# EAGLE design msp430fr5994-LQFP_80 (EAGLE 7.5.0)

## Sheet 1 of 2
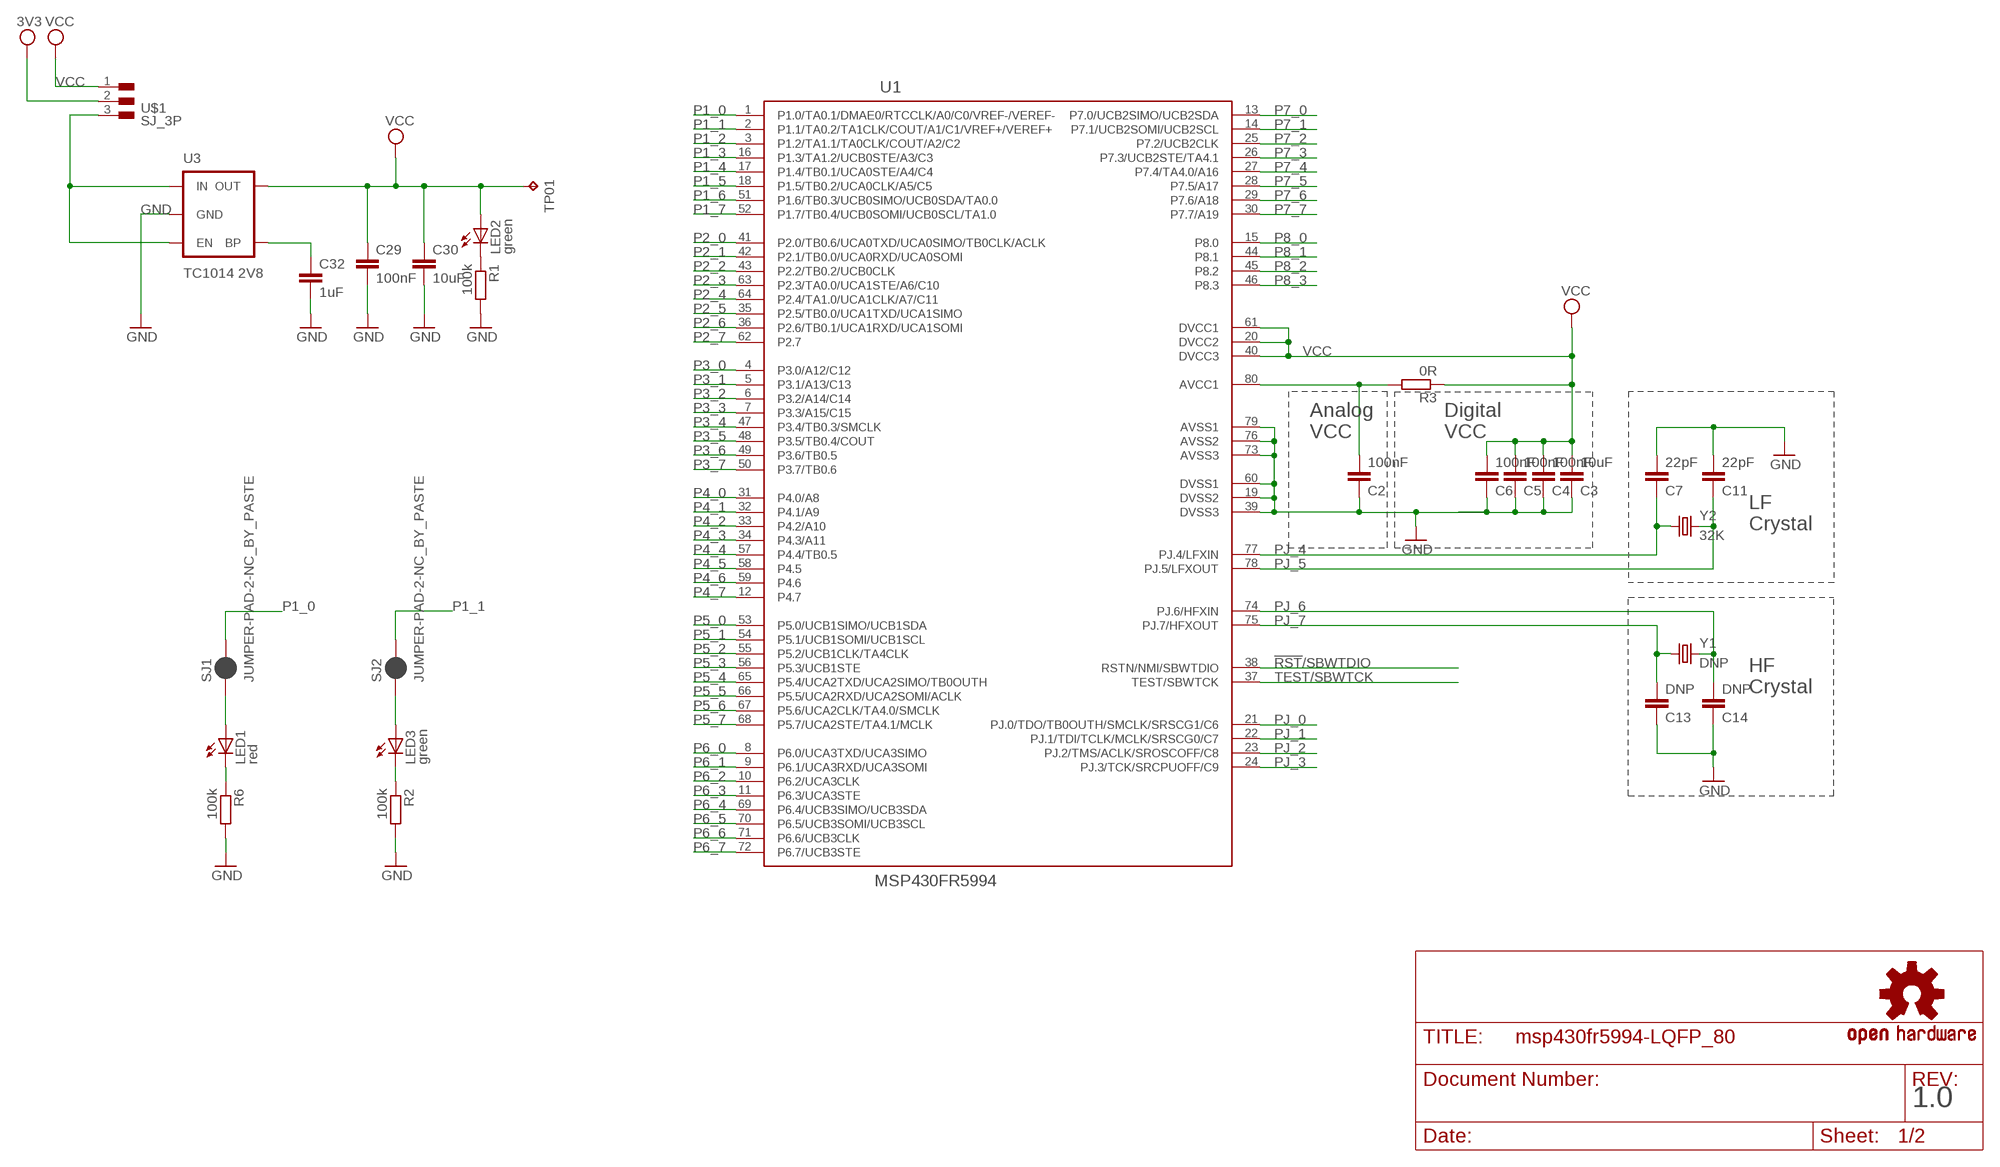
[diagram p0: schematic, sheet 1]

### Parts
C2  100nF  C-EUC0805  [C0805]
C3  10uF  C-EUC0805  [C0805]
C4  100nF  C-EUC0805  [C0805]
C5  100nF  C-EUC0805  [C0805]
C6  100nF  C-EUC0805  [C0805]
C7  22pF  C-EUC0805  [C0805]
C11  22pF  C-EUC0805  [C0805]
C13  DNP  C-EUC0805  [C0805]
C14  DNP  C-EUC0805  [C0805]
C29  100nF  C-EUC0805  [C0805]
C30  10uF  C-EUC1206  [C1206]
C32  1uF  C-EUC0805  [C0805]
LED1  red  LEDCHIPLED_0805  [CHIPLED_0805]
LED2  green  LEDCHIPLED_0805  [CHIPLED_0805]
LED3  green  LEDCHIPLED_0805  [CHIPLED_0805]
R1  100k  R-EU_R0805W  [R0805W]
R2  100k  R-EU_R0805W  [R0805W]
R3  0R  R-EU_R0805W  [R0805W]
R6  100k  R-EU_R0805W  [R0805W]
SJ1  JUMPER-PAD-2-NC_BY_PASTE  [PAD-JUMPER-2-NC_BY_PASTE_YES_SILK]
SJ2  JUMPER-PAD-2-NC_BY_PASTE  [PAD-JUMPER-2-NC_BY_PASTE_YES_SILK]
TP01  TPTP12R  [TP12R]
U1  MSP430FR5994  [PN80]
U3  TC1014 2V8  V_REG_LDOSMD  [SOT23-5]
U$1  SJ_3P  [SJ_3P]
U$7  OSHW-LOGOM  [OSHW-LOGO-M]
Y1  DNP  CRYSTAL  [CRYSTAL-SMD-11.4X4.35]
Y2  32K  CRYSTAL3.2X1.5  [CRYSTAL-SMD-3.2X1.5]

### Nets
3V3: U$1.2 ; also sheet 2
!RST!/SBWTDIO: U1.38(RSTN/NMI/SBWTDIO) ; also sheet 2
GND: C2.1 C3.1 C4.1 C5.1 C6.1 C7.2 C11.2 C13.1 C14.1 C29.2 C30.2 C32.2 R1.2 R2.2 R6.2 U1.19(DVSS2) U1.39(DVSS3) U1.60(DVSS1) U1.73(AVSS3) U1.76(AVSS2) U1.79(AVSS1) U3.2(GND) ; also sheet 2
N$1: U3.1(IN) U3.3(EN) U$1.3
N$2: C2.2 R3.2 U1.80(AVCC1)
N$3: LED2.C R1.1
N$4: LED1.A SJ1.1
N$5: LED3.C R2.1
N$6: LED3.A SJ2.1
N$8: LED1.C R6.1
N$50: C32.1 U3.4(BP)
P1_0: SJ1.2 U1.1(P1.0/TA0.1/DMAE0/RTCCLK/A0/C0/VREF-/VEREF-) ; also sheet 2
P1_1: SJ2.2 U1.2(P1.1/TA0.2/TA1CLK/COUT/A1/C1/VREF+/VEREF+) ; also sheet 2
P1_2: U1.3(P1.2/TA1.1/TA0CLK/COUT/A2/C2) ; also sheet 2
P1_3: U1.16(P1.3/TA1.2/UCB0STE/A3/C3) ; also sheet 2
P1_4: U1.17(P1.4/TB0.1/UCA0STE/A4/C4) ; also sheet 2
P1_5: U1.18(P1.5/TB0.2/UCA0CLK/A5/C5) ; also sheet 2
P1_6: U1.51(P1.6/TB0.3/UCB0SIMO/UCB0SDA/TA0.0) ; also sheet 2
P1_7: U1.52(P1.7/TB0.4/UCB0SOMI/UCB0SCL/TA1.0) ; also sheet 2
P2_0: U1.41(P2.0/TB0.6/UCA0TXD/UCA0SIMO/TB0CLK/ACLK) ; also sheet 2
P2_1: U1.42(P2.1/TB0.0/UCA0RXD/UCA0SOMI) ; also sheet 2
P2_2: U1.43(P2.2/TB0.2/UCB0CLK) ; also sheet 2
P2_3: U1.63(P2.3/TA0.0/UCA1STE/A6/C10) ; also sheet 2
P2_4: U1.64(P2.4/TA1.0/UCA1CLK/A7/C11) ; also sheet 2
P2_5: U1.35(P2.5/TB0.0/UCA1TXD/UCA1SIMO) ; also sheet 2
P2_6: U1.36(P2.6/TB0.1/UCA1RXD/UCA1SOMI) ; also sheet 2
P2_7: U1.62(P2.7) ; also sheet 2
P3_0: U1.4(P3.0/A12/C12) ; also sheet 2
P3_1: U1.5(P3.1/A13/C13) ; also sheet 2
P3_2: U1.6(P3.2/A14/C14) ; also sheet 2
P3_3: U1.7(P3.3/A15/C15) ; also sheet 2
P3_4: U1.47(P3.4/TB0.3/SMCLK) ; also sheet 2
P3_5: U1.48(P3.5/TB0.4/COUT) ; also sheet 2
P3_6: U1.49(P3.6/TB0.5) ; also sheet 2
P3_7: U1.50(P3.7/TB0.6) ; also sheet 2
P4_0: U1.31(P4.0/A8) ; also sheet 2
P4_1: U1.32(P4.1/A9) ; also sheet 2
P4_2: U1.33(P4.2/A10) ; also sheet 2
P4_3: U1.34(P4.3/A11) ; also sheet 2
P4_4: U1.57(P4.4/TB0.5) ; also sheet 2
P4_5: U1.58(P4.5) ; also sheet 2
P4_6: U1.59(P4.6) ; also sheet 2
P4_7: U1.12(P4.7) ; also sheet 2
P5_0: U1.53(P5.0/UCB1SIMO/UCB1SDA) ; also sheet 2
P5_1: U1.54(P5.1/UCB1SOMI/UCB1SCL) ; also sheet 2
P5_2: U1.55(P5.2/UCB1CLK/TA4CLK) ; also sheet 2
P5_3: U1.56(P5.3/UCB1STE) ; also sheet 2
P5_4: U1.65(P5.4/UCA2TXD/UCA2SIMO/TB0OUTH) ; also sheet 2
P5_5: U1.66(P5.5/UCA2RXD/UCA2SOMI/ACLK) ; also sheet 2
P5_6: U1.67(P5.6/UCA2CLK/TA4.0/SMCLK) ; also sheet 2
P5_7: U1.68(P5.7/UCA2STE/TA4.1/MCLK) ; also sheet 2
P6_0: U1.8(P6.0/UCA3TXD/UCA3SIMO) ; also sheet 2
P6_1: U1.9(P6.1/UCA3RXD/UCA3SOMI) ; also sheet 2
P6_2: U1.10(P6.2/UCA3CLK) ; also sheet 2
P6_3: U1.11(P6.3/UCA3STE) ; also sheet 2
P6_4: U1.69(P6.4/UCB3SIMO/UCB3SDA) ; also sheet 2
P6_5: U1.70(P6.5/UCB3SOMI/UCB3SCL) ; also sheet 2
P6_6: U1.71(P6.6/UCB3CLK) ; also sheet 2
P6_7: U1.72(P6.7/UCB3STE) ; also sheet 2
P7_0: U1.13(P7.0/UCB2SIMO/UCB2SDA) ; also sheet 2
P7_1: U1.14(P7.1/UCB2SOMI/UCB2SCL) ; also sheet 2
P7_2: U1.25(P7.2/UCB2CLK) ; also sheet 2
P7_3: U1.26(P7.3/UCB2STE/TA4.1) ; also sheet 2
P7_4: U1.27(P7.4/TA4.0/A16) ; also sheet 2
P7_5: U1.28(P7.5/A17) ; also sheet 2
P7_6: U1.29(P7.6/A18) ; also sheet 2
P7_7: U1.30(P7.7/A19) ; also sheet 2
P8_0: U1.15(P8.0) ; also sheet 2
P8_1: U1.44(P8.1) ; also sheet 2
P8_2: U1.45(P8.2) ; also sheet 2
P8_3: U1.46(P8.3) ; also sheet 2
PJ_0: U1.21(PJ.0/TDO/TB0OUTH/SMCLK/SRSCG1/C6) ; also sheet 2
PJ_1: U1.22(PJ.1/TDI/TCLK/MCLK/SRSCG0/C7) ; also sheet 2
PJ_2: U1.23(PJ.2/TMS/ACLK/SROSCOFF/C8) ; also sheet 2
PJ_3: U1.24(PJ.3/TCK/SRCPUOFF/C9) ; also sheet 2
PJ_4: C7.1 U1.77(PJ.4/LFXIN) Y2.P$1
PJ_5: C11.1 U1.78(PJ.5/LFXOUT) Y2.P$2
PJ_6: C14.2 U1.74(PJ.6/HFXIN) Y1.2
PJ_7: C13.2 U1.75(PJ.7/HFXOUT) Y1.1
TEST/SBWTCK: U1.37(TEST/SBWTCK) ; also sheet 2
VCC: C3.2 C4.2 C5.2 C6.2 C29.1 C30.1 LED2.A R3.1 TP01.TP U1.20(DVCC2) U1.40(DVCC3) U1.61(DVCC1) U3.5(OUT) U$1.1 ; also sheet 2

### Notes on the sheet
- Analog | Digital
- VCC | VCC
- LF
- Crystal
- HF
- Crystal
- 1.0

## Sheet 2 of 2
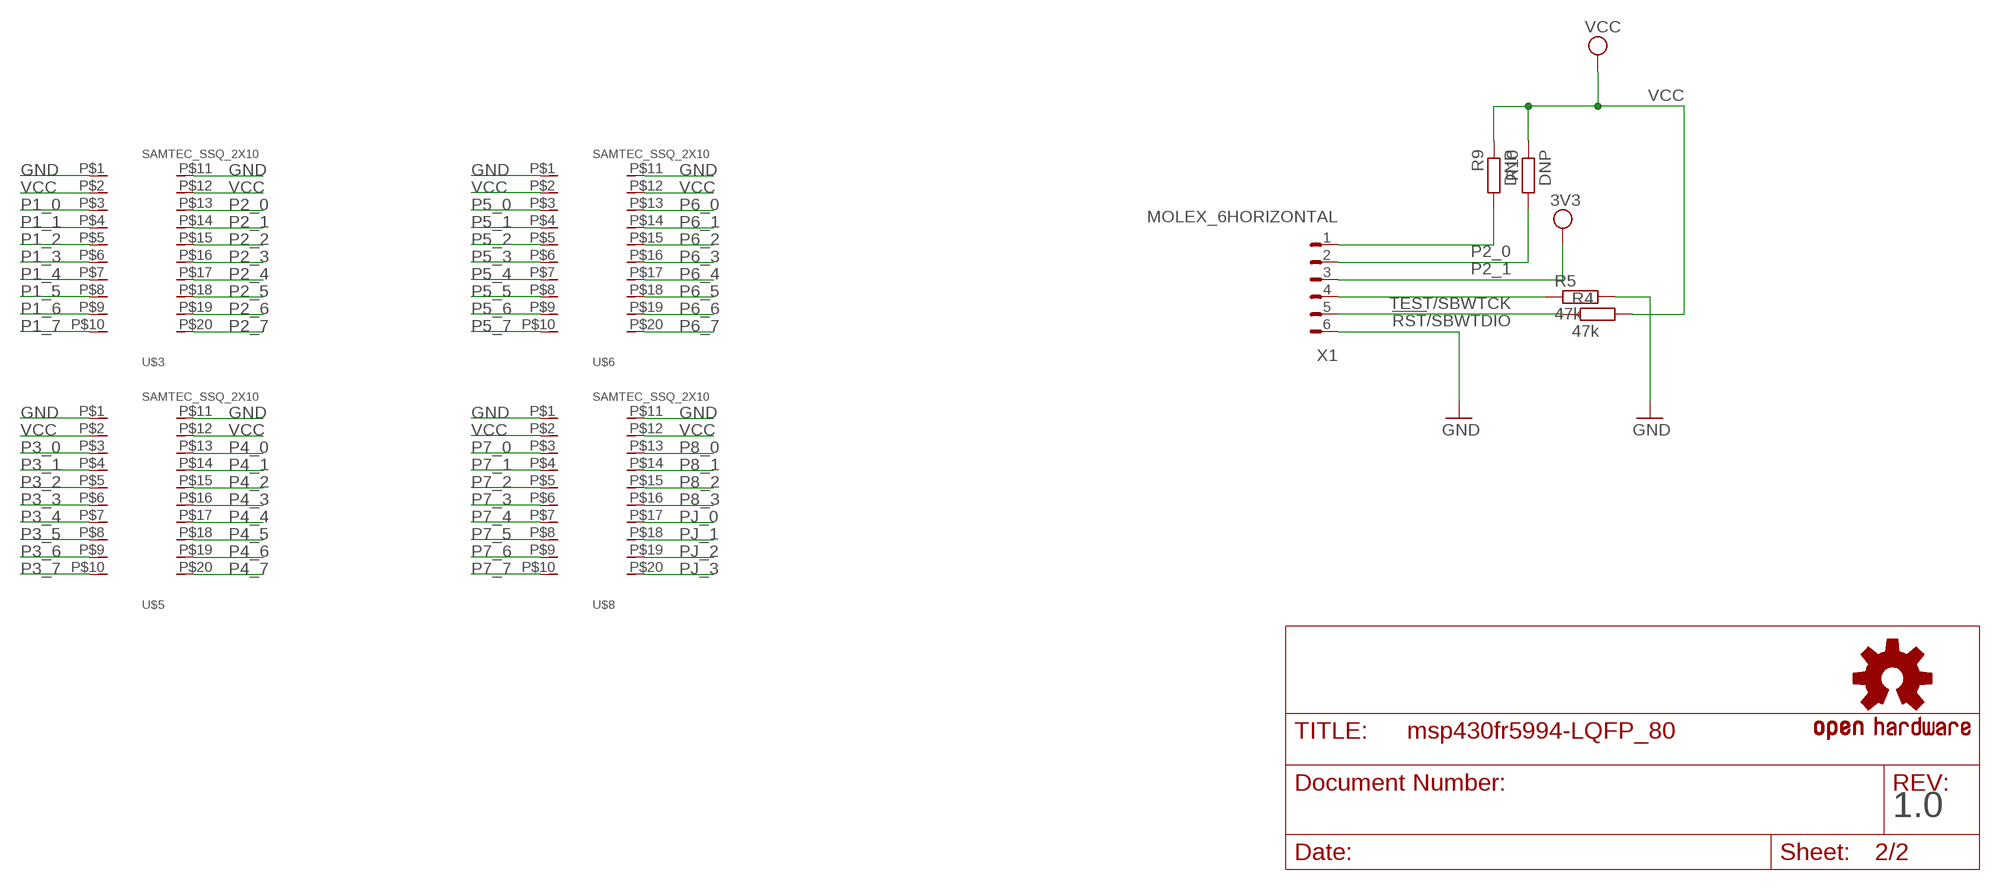
[diagram p1: schematic, sheet 2]

### Parts
R4  47k  R-EU_R0805W  [R0805W]
R5  47k  R-EU_R0805W  [R0805W]
R9  DNP  R-EU_R0805W  [R0805W]
R10  DNP  R-EU_R0805W  [R0805W]
U$2  OSHW-LOGOM  [OSHW-LOGO-M]
U$3  SAMTEC_SSQ_2X10  [SSQ-110-03-G-D]
U$5  SAMTEC_SSQ_2X10  [SSQ-110-03-G-D]
U$6  SAMTEC_SSQ_2X10  [SSQ-110-03-G-D]
U$8  SAMTEC_SSQ_2X10  [SSQ-110-03-G-D]
X1  MOLEX_6HORIZONTAL  [0530480610]

### Nets
3V3: X1.3 ; also sheet 1
!RST!/SBWTDIO: R4.1 X1.5 ; also sheet 1
GND: R5.2 U$3.P$1 U$3.P$11 U$5.P$1 U$5.P$11 U$6.P$1 U$6.P$11 U$8.P$1 U$8.P$11 X1.6 ; also sheet 1
P1_0: U$3.P$3 ; also sheet 1
P1_1: U$3.P$4 ; also sheet 1
P1_2: U$3.P$5 ; also sheet 1
P1_3: U$3.P$6 ; also sheet 1
P1_4: U$3.P$7 ; also sheet 1
P1_5: U$3.P$8 ; also sheet 1
P1_6: U$3.P$9 ; also sheet 1
P1_7: U$3.P$10 ; also sheet 1
P2_0: R9.2 U$3.P$13 X1.1 ; also sheet 1
P2_1: R10.2 U$3.P$14 X1.2 ; also sheet 1
P2_2: U$3.P$15 ; also sheet 1
P2_3: U$3.P$16 ; also sheet 1
P2_4: U$3.P$17 ; also sheet 1
P2_5: U$3.P$18 ; also sheet 1
P2_6: U$3.P$19 ; also sheet 1
P2_7: U$3.P$20 ; also sheet 1
P3_0: U$5.P$3 ; also sheet 1
P3_1: U$5.P$4 ; also sheet 1
P3_2: U$5.P$5 ; also sheet 1
P3_3: U$5.P$6 ; also sheet 1
P3_4: U$5.P$7 ; also sheet 1
P3_5: U$5.P$8 ; also sheet 1
P3_6: U$5.P$9 ; also sheet 1
P3_7: U$5.P$10 ; also sheet 1
P4_0: U$5.P$13 ; also sheet 1
P4_1: U$5.P$14 ; also sheet 1
P4_2: U$5.P$15 ; also sheet 1
P4_3: U$5.P$16 ; also sheet 1
P4_4: U$5.P$17 ; also sheet 1
P4_5: U$5.P$18 ; also sheet 1
P4_6: U$5.P$19 ; also sheet 1
P4_7: U$5.P$20 ; also sheet 1
P5_0: U$6.P$3 ; also sheet 1
P5_1: U$6.P$4 ; also sheet 1
P5_2: U$6.P$5 ; also sheet 1
P5_3: U$6.P$6 ; also sheet 1
P5_4: U$6.P$7 ; also sheet 1
P5_5: U$6.P$8 ; also sheet 1
P5_6: U$6.P$9 ; also sheet 1
P5_7: U$6.P$10 ; also sheet 1
P6_0: U$6.P$13 ; also sheet 1
P6_1: U$6.P$14 ; also sheet 1
P6_2: U$6.P$15 ; also sheet 1
P6_3: U$6.P$16 ; also sheet 1
P6_4: U$6.P$17 ; also sheet 1
P6_5: U$6.P$18 ; also sheet 1
P6_6: U$6.P$19 ; also sheet 1
P6_7: U$6.P$20 ; also sheet 1
P7_0: U$8.P$3 ; also sheet 1
P7_1: U$8.P$4 ; also sheet 1
P7_2: U$8.P$5 ; also sheet 1
P7_3: U$8.P$6 ; also sheet 1
P7_4: U$8.P$7 ; also sheet 1
P7_5: U$8.P$8 ; also sheet 1
P7_6: U$8.P$9 ; also sheet 1
P7_7: U$8.P$10 ; also sheet 1
P8_0: U$8.P$13 ; also sheet 1
P8_1: U$8.P$14 ; also sheet 1
P8_2: U$8.P$15 ; also sheet 1
P8_3: U$8.P$16 ; also sheet 1
PJ_0: U$8.P$17 ; also sheet 1
PJ_1: U$8.P$18 ; also sheet 1
PJ_2: U$8.P$19 ; also sheet 1
PJ_3: U$8.P$20 ; also sheet 1
TEST/SBWTCK: R5.1 X1.4 ; also sheet 1
VCC: R4.2 R9.1 R10.1 U$3.P$2 U$3.P$12 U$5.P$2 U$5.P$12 U$6.P$2 U$6.P$12 U$8.P$2 U$8.P$12 ; also sheet 1

### Notes on the sheet
- 1.0

## Library data of the parts
C2-C7 C11 C13 C14 C29 C30 C32 = rcl:C-EU: CAPACITOR, European symbol
LED1-LED3 = led:LED: LED OSRAM: - CHIPLED LG R971, LG N971, LY N971, LG Q971, LY Q971, LO R971, LY R971 LH N974, LH R974 LS Q976, LO Q976, LY Q976 LO Q996 - Hyper CHIPLED LW Q18S LB Q993, LB Q99A, LB R99A - SideLED LS A670, LO A670, LY A670, LG A670, LP A670 LB A673, LV A673, LT A673, LW A673 LH A674 LY A675 LS A676, LA A676, LO A676, LY A676, LW A676 LS A679, LY A679, LG A679 - Hyper Micro SIDELED® LS Y876, LA Y876, LO Y876, LY Y876 LT Y87S - SmartLED LW L88C, LW L88S LB L89C, LB L89S, LG L890 LS L89K, LO L89K, LY L89K LS L896, LA L896, LO L896, LY L896 - TOPLED LS T670, LO T670, LY T670, LG T670, LP T670 LSG T670, LSP T670, LSY T670, LOP T670, LYG T670 LG T671, LOG T671, LSG T671 LB T673, LV T673, LT T673, LW T673 LH T674 LS T676, LA T676, LO T676, LY T676, LB T676, LH T676, LSB T676, LW T676 LB T67C, LV T67C, LT T67C, LS T67K, LO T67K, LY T67K, LW E67C LS E67B, LA E67B, LO E67B, LY E67B, LB E67C, LV E67C, LT E67C LW T67C LS T679, LY T679, LG T679 LS T770, LO T770, LY T770, LG T770, LP T770 LB T773, LV T773, LT T773, LW T773 LH T774 LS E675, LA E675, LY E675, LS T675 LS T776, LA T776, LO T776, LY T776, LB T776 LHGB T686 LT T68C, LB T68C - Hyper Mini TOPLED® LB M676 - Mini TOPLED Santana® LG M470 LS M47K, LO M47K, LY M47K Source: http://www.osram.convergy.de LUXEON: - LUMILED® LXK2-PW12-R00, LXK2-PW12-S00, LXK2-PW14-U00, LXK2-PW14-V00 LXK2-PM12-R00, LXK2-PM12-S00, LXK2-PM14-U00 LXK2-PE12-Q00, LXK2-PE12-R00, LXK2-PE12-S00, LXK2-PE14-T00, LXK2-PE14-U00 LXK2-PB12-K00, LXK2-PB12-L00, LXK2-PB12-M00, LXK2-PB14-N00, LXK2-PB14-P00, LXK2-PB14-Q00 LXK2-PR12-L00, LXK2-PR12-M00, LXK2-PR14-Q00, LXK2-PR14-R00 LXK2-PD12-Q00, LXK2-PD12-R00, LXK2-PD12-S00 LXK2-PH12-R00, LXK2-PH12-S00 LXK2-PL12-P00, LXK2-PL12-Q00, LXK2-PL12-R00 Source: www.luxeon.com KINGBRIGHT: KA-3528ASYC Source: www.kingbright.com
R1-R6 R9 R10 = rcl:R-EU_: RESISTOR, European symbol
SJ1 SJ2 = SparkFun-Passives:JUMPER-PAD-2-NC_BY_PASTE
TP01 = testpad:TP: Test pad
U1 = MSP_IC:MSP430FR5994
U3 = SparkFun:V_REG_LDO: Voltage Regulator LDO Standard 150mA LDO voltage regulator in SOT-23 layout. Micrel part MIC5205. BP (by-pass) pin is used to lower output noise with 470pF cap.
U$1 = Simplex-Jumpers:SJ_3P: solder jumper 3 pin
U$2 U$7 = SparkFun:OSHW-LOGO: Open Source Hardware Logo This logo indicates the piece of hardware it is found on incorporates a OSHW license and/or adheres to the definition of open source hardware found here: http://freedomdefined.org/OSHW
U$3 U$5 U$6 U$8 = Simplex-Connectors:SAMTEC_SSQ_2X10: Samtec SSQ 2x10 pin header
X1 = Simplex-Connectors:MOLEX_6: Molex 6 pin connectors 1.25mm PicoBlade
Y1 Y2 = Simplex-FreqCtrl:CRYSTAL: smd crystals

## Net classes
0 default: width 0.254 mm
1 vcc: width 0.203 mm

## Board
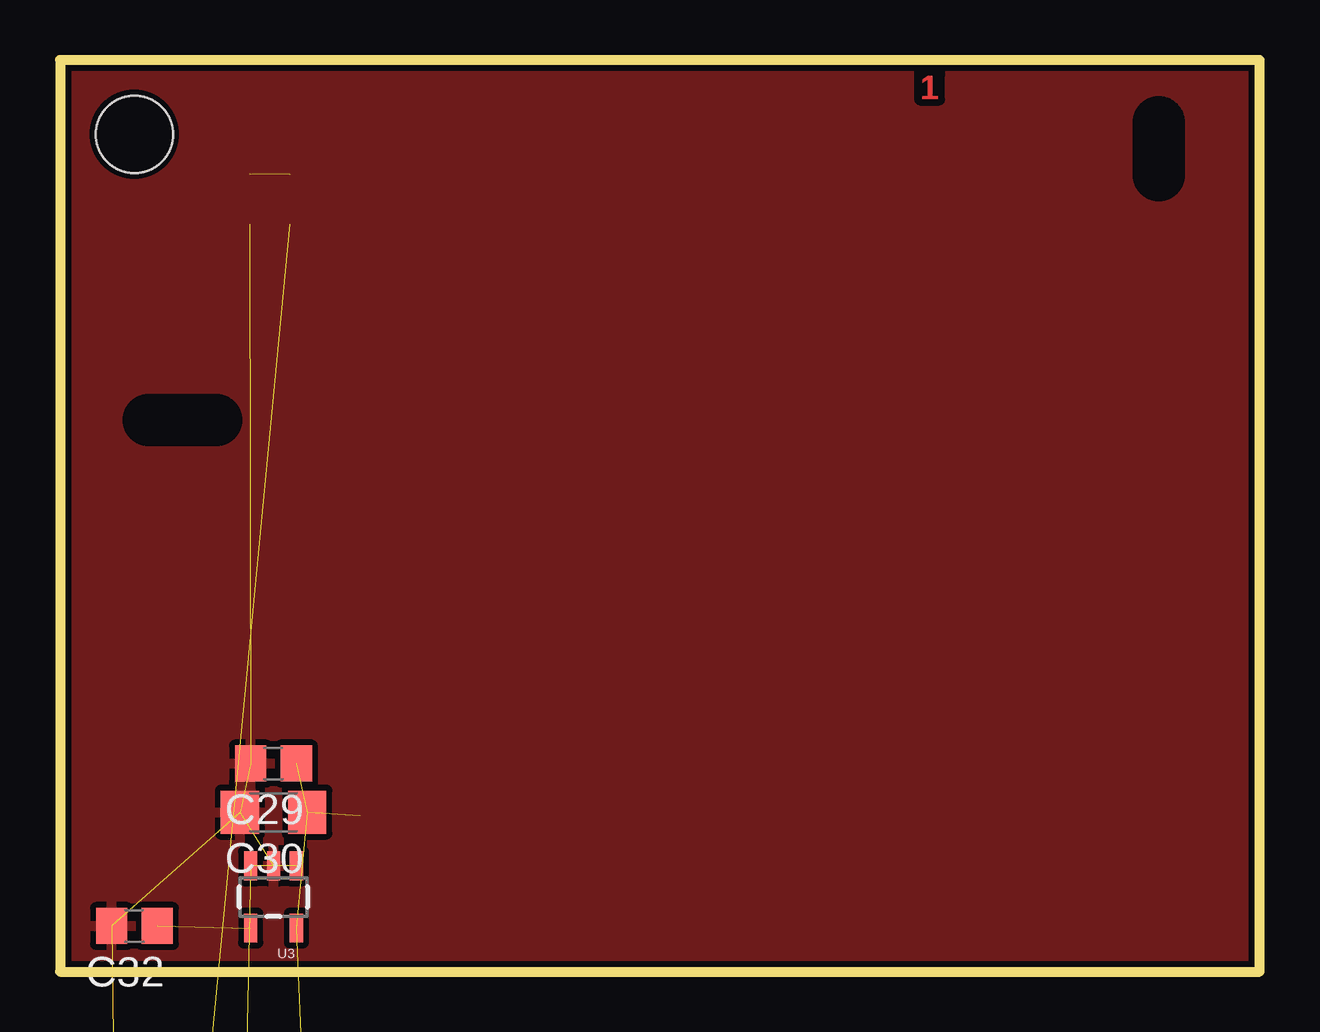
[diagram p2: board, top side]
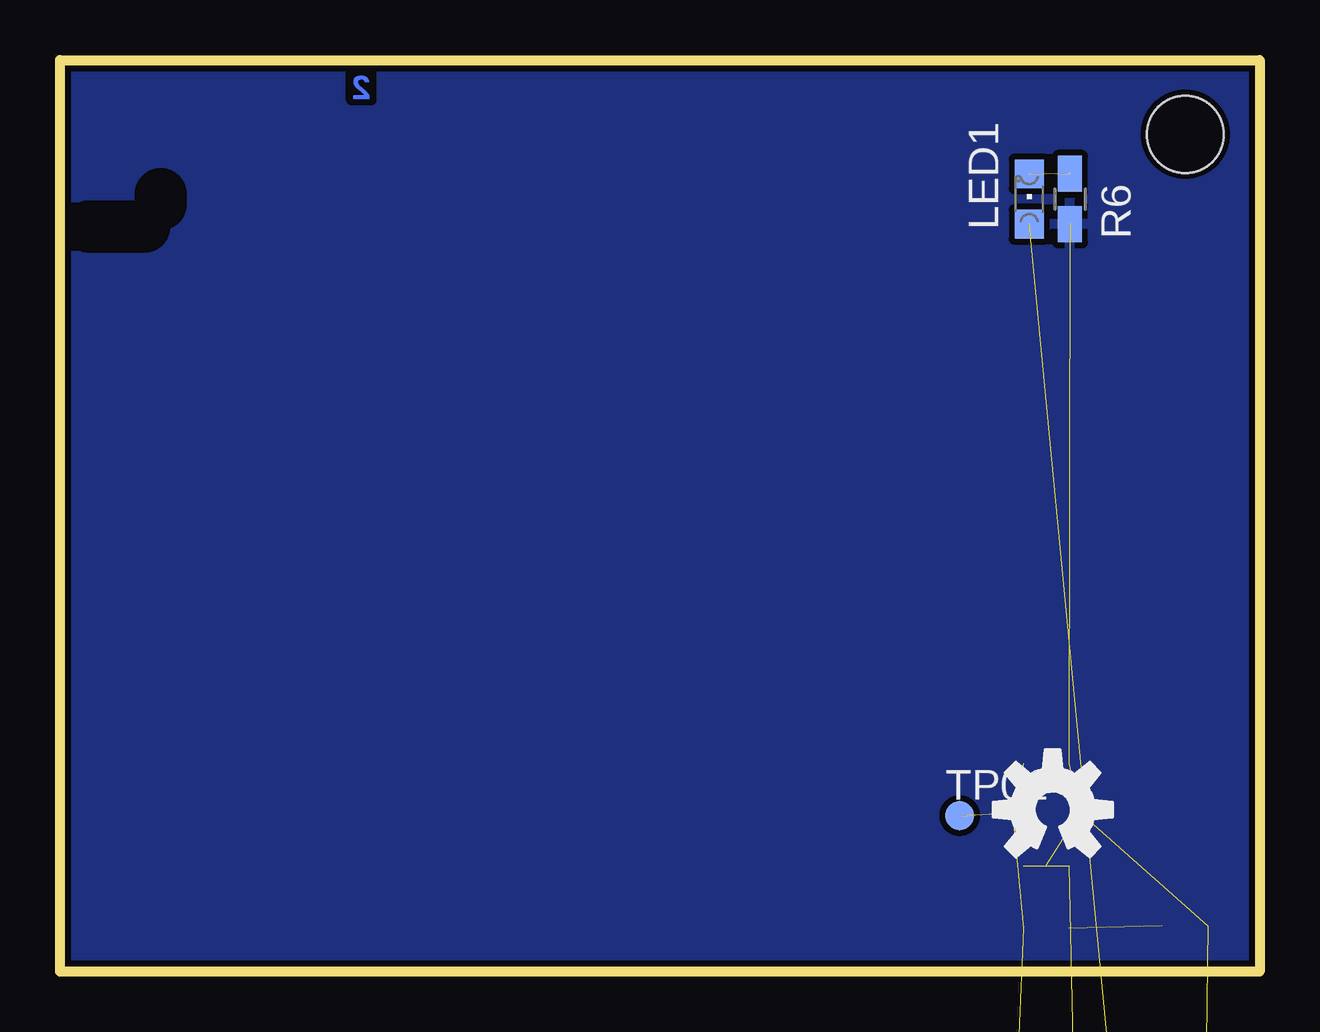
[diagram p3: board, bottom side, seen from below]

Size 50 x 38 mm. Coordinates in mm from the lower left corner, seen from the top.
Outline: 0,0 50,0 50,38 0,38 0,0
Copper layers (1*16): Top 0.035mm / dielectric 1.5mm / Bottom 0.035mm
Design rules "seeedstudio_rules_v1.1 *": minimum track width 6mil, minimum drill 12mil, track to track 6mil, track to pad 6mil, pad to pad 6mil, via to via 6mil, smd to smd 0mil, copper to edge 10mil, drill to drill 10mil, minimum pad ring 0.154mm, minimum via ring 6mil, stop-mask expansion 2mil, vias tented up to drill 100mil, thermal gap 10mil
Holes 3.2 mm at 3.1,34.9
tRestrict: 2 lines
bRestrict: 2 lines

### Footprints (pad centres in the part's own frame; a part is rotated, then mirrored left to right if it is on the bottom)
C0805 = smd 1.3 x 1.5: 1 -0.95,0; 2 0.95,0
C1206 = smd 1.6 x 1.8: 1 -1.4,0; 2 1.4,0
CHIPLED_0805 = smd 1.2 x 1.2: A 0,-1.05; C 0,1.05
R0805W = smd 1.5 x 1: 1 -1.052,0; 2 1.052,0
PAD-JUMPER-2-NC_BY_PASTE_YES_SILK = smd 0.635 x 1.27: 1 -0.401,0; 2 0.413,0
TP12R = smd 1.2 x 1.2: TP 0,0
PN80 = smd 1.35 x 0.3: 1 -6.825,4.75; 2 -6.825,4.25; 3 -6.825,3.75; 4 -6.825,3.25; 5 -6.825,2.75; 6 -6.825,2.25; 7 -6.825,1.75; 8 -6.825,1.25; 9 -6.825,0.75; 10 -6.825,0.25; 11 -6.825,-0.25; 12 -6.825,-0.75; 13 -6.825,-1.25; 14 -6.825,-1.75; 15 -6.825,-2.25; 16 -6.825,-2.75; 17 -6.825,-3.25; 18 -6.825,-3.75; 19 -6.825,-4.25; 20 -6.825,-4.75; 41 6.825,-4.75; 42 6.825,-4.25; 43 6.825,-3.75; 44 6.825,-3.25; 45 6.825,-2.75; 46 6.825,-2.25; 47 6.825,-1.75; 48 6.825,-1.25; 49 6.825,-0.75; 50 6.825,-0.25; 51 6.825,0.25; 52 6.825,0.75; 53 6.825,1.25; 54 6.825,1.75; 55 6.825,2.25; 56 6.825,2.75; 57 6.825,3.25; 58 6.825,3.75; 59 6.825,4.25; 60 6.825,4.75 | smd 0.3 x 1.35: 21 -4.75,-6.825; 22 -4.25,-6.825; 23 -3.75,-6.825; 24 -3.25,-6.825; 25 -2.75,-6.825; 26 -2.25,-6.825; 27 -1.75,-6.825; 28 -1.25,-6.825; 29 -0.75,-6.825; 30 -0.25,-6.825; 31 0.25,-6.825; 32 0.75,-6.825; 33 1.25,-6.825; 34 1.75,-6.825; 35 2.25,-6.825; 36 2.75,-6.825; 37 3.25,-6.825; 38 3.75,-6.825; 39 4.25,-6.825; 40 4.75,-6.825; 61 4.75,6.825; 62 4.25,6.825; 63 3.75,6.825; 64 3.25,6.825; 65 2.75,6.825; 66 2.25,6.825; 67 1.75,6.825; 68 1.25,6.825; 69 0.75,6.825; 70 0.25,6.825; 71 -0.25,6.825; 72 -0.75,6.825; 73 -1.25,6.825; 74 -1.75,6.825; 75 -2.25,6.825; 76 -2.75,6.825; 77 -3.25,6.825; 78 -3.75,6.825; 79 -4.25,6.825; 80 -4.75,6.825
SOT23-5 = smd 0.55 x 1.2: 1 -0.95,-1.3; 2 0,-1.3; 3 0.95,-1.3; 4 0.95,1.3; 5 -0.95,1.3
SJ_3P = smd 1.2 x 1.6: 1 0,0; 2 1.5,0; 3 3,0
SSQ-110-03-G-D = drill 1.02 square: P$1 0,0 | drill 1.02: P$2 2.54,0; P$3 5.08,0; P$4 7.62,0; P$5 10.16,0; P$6 12.7,0; P$7 15.24,0; P$8 17.78,0; P$9 20.32,0; P$10 22.86,0; P$11 0,2.54; P$12 2.54,2.54; P$13 5.08,2.54; P$14 7.62,2.54; P$15 10.16,2.54; P$16 12.7,2.54; P$17 15.24,2.54; P$18 17.78,2.54; P$19 20.32,2.54; P$20 22.86,2.54
0530480610 = drill 0.6 pad 0.9 long: 1 0,0; 2 1.25,0; 3 2.5,0; 4 3.75,0; 5 5,0; 6 6.25,0
CRYSTAL-SMD-11.4X4.35 = smd 5.5 x 2: 1 -4.75,0; 2 4.75,0
CRYSTAL-SMD-3.2X1.5 = smd 1.1 x 1.9: P$1 -1.25,0; P$2 1.25,0

### Placement (x,y rotation side)
C2  1,-103 0 top  (outside the outline)
C3  1,-110 0 top  (outside the outline)
C4  1,-117 0 top  (outside the outline)
C5  1,-124 0 top  (outside the outline)
C6  1,-131 0 top  (outside the outline)
C7  1,-138 0 top  (outside the outline)
C11  1,-145 0 top  (outside the outline)
C13  1,-152 0 top  (outside the outline)
C14  1,-159 0 top  (outside the outline)
C29  8.9,8.67 180 top
C30  8.9,6.64 180 top
C32  3.1,1.9 180 top
LED1  9.6,32.2 0 bottom
LED2  -5,-173 0 top  (outside the outline)
LED3  -12,-180 0 top  (outside the outline)
R1  -5,-179 0 top  (outside the outline)
R2  -12,-186 0 top  (outside the outline)
R3  1,-96 0 top  (outside the outline)
R4  0,-244 0 top  (outside the outline)
R5  -12,-251 0 top  (outside the outline)
R6  7.9,32.2 270 bottom
R9  -12,-244 0 top  (outside the outline)
R10  -6,-244 0 top  (outside the outline)
SJ1  -17,-251 0 top  (outside the outline)
SJ2  -20,-251 0 top  (outside the outline)
TP01  12.5,6.5 0 bottom
U1  7,-50 0 top  (outside the outline)
U3  8.9,3.11 180 top
U$1  1,-174 0 top  (outside the outline)
U$2  -12,-192 0 top  (outside the outline)
U$3  -13,-201 0 top  (outside the outline)
U$5  -13,-210 0 top  (outside the outline)
U$6  -13,-219 0 top  (outside the outline)
U$7  8.62,6.75 0 bottom
U$8  -13,-228 0 top  (outside the outline)
X1  -13,-234 0 top  (outside the outline)
Y1  7,-165 0 top  (outside the outline)
Y2  1,-169 0 top  (outside the outline)

### Tracks (layer width: path | path; a pad name or v marks a point on that pad's centre or on a via)
3V3  (1 unrouted)
!RST!/SBWTDIO  (2 unrouted)
GND  (31 unrouted)
  pour Top (isolate 0.254): 0,38 50,38 50,0 0,0
  pour Bottom (isolate 0.254): 0,38 50,38 50,0 0,0
N$1  (2 unrouted)
N$2  (2 unrouted)
N$3  (1 unrouted)
N$4  (1 unrouted)
N$5  (1 unrouted)
N$6  (1 unrouted)
N$8  (1 unrouted)
N$50  (1 unrouted)
P1_0  (2 unrouted)
P1_1  (2 unrouted)
P1_2  (1 unrouted)
P1_3  (1 unrouted)
P1_4  (1 unrouted)
P1_5  (1 unrouted)
P1_6  (1 unrouted)
P1_7  (1 unrouted)
P2_0  (3 unrouted)
P2_1  (3 unrouted)
P2_2  (1 unrouted)
P2_3  (1 unrouted)
P2_4  (1 unrouted)
P2_5  (1 unrouted)
P2_6  (1 unrouted)
P2_7  (1 unrouted)
P3_0  (1 unrouted)
P3_1  (1 unrouted)
P3_2  (1 unrouted)
P3_3  (1 unrouted)
P3_4  (1 unrouted)
P3_5  (1 unrouted)
P3_6  (1 unrouted)
P3_7  (1 unrouted)
P4_0  (1 unrouted)
P4_1  (1 unrouted)
P4_2  (1 unrouted)
P4_3  (1 unrouted)
P4_4  (1 unrouted)
P4_5  (1 unrouted)
P4_6  (1 unrouted)
P4_7  (1 unrouted)
P5_0  (1 unrouted)
P5_1  (1 unrouted)
P5_2  (1 unrouted)
P5_3  (1 unrouted)
P5_4  (1 unrouted)
P5_5  (1 unrouted)
P5_6  (1 unrouted)
P5_7  (1 unrouted)
P6_0  (1 unrouted)
P6_1  (1 unrouted)
P6_2  (1 unrouted)
P6_3  (1 unrouted)
P6_4  (1 unrouted)
P6_5  (1 unrouted)
P6_6  (1 unrouted)
P6_7  (1 unrouted)
P7_0  (1 unrouted)
P7_1  (1 unrouted)
P7_2  (1 unrouted)
P7_3  (1 unrouted)
P7_4  (1 unrouted)
P7_5  (1 unrouted)
P7_6  (1 unrouted)
P7_7  (1 unrouted)
P8_0  (1 unrouted)
P8_1  (1 unrouted)
P8_2  (1 unrouted)
P8_3  (1 unrouted)
PJ_0  (1 unrouted)
PJ_1  (1 unrouted)
PJ_2  (1 unrouted)
PJ_3  (1 unrouted)
PJ_4  (2 unrouted)
PJ_5  (2 unrouted)
PJ_6  (2 unrouted)
PJ_7  (2 unrouted)
TEST/SBWTCK  (2 unrouted)
VCC  (24 unrouted)

### Text on the board
Top: 1
Bottom: 2
tmine: gps | gsm | 10KOhm / ts | 3.7V / bat | 5V | debug
bmine: status | tp6 | tp2 | tp1 | tp4 | tp3 | tp5 | +3V3 | +2V8 | github.com/rodan/tracy | Petre Rodan 201411 rev2.1